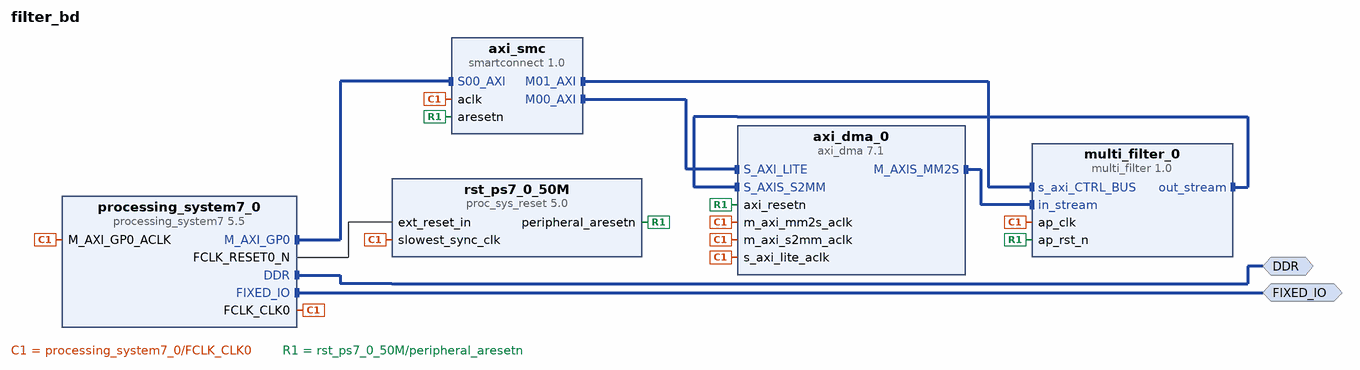
[diagram p0: block diagram of the top level]
# Vivado block design filter_bd, xc7z020clg484-1, Vivado 2024.2
create_bd_design filter_bd

create_bd_intf_port -mode Master -vlnv xilinx.com:interface:ddrx_rtl:1.0 DDR
create_bd_intf_port -mode Master -vlnv xilinx.com:display_processing_system7:fixedio_rtl:1.0 FIXED_IO

create_bd_cell -type ip -vlnv xilinx.com:ip:processing_system7:5.5 processing_system7_0
set_property -dict [list \
  CONFIG.PCW_UART1_PERIPHERAL_ENABLE 1 \
  CONFIG.PCW_UART1_UART1_IO {MIO 48 .. 49} \
  CONFIG.PCW_UART_PERIPHERAL_FREQMHZ 100 \
] [get_bd_cells processing_system7_0]
# 41 more settings of processing_system7_0 are not shown: defaults, MIO pin electricals, DDR timing, and values the tool derives
create_bd_cell -type ip -vlnv xilinx.com:ip:axi_dma:7.1 axi_dma_0
set_property -dict [list \
  CONFIG.c_include_sg 0 \
  CONFIG.c_m_axis_mm2s_tdata_width 8 \
  CONFIG.c_s_axis_s2mm_tdata_width 8 \
] [get_bd_cells axi_dma_0]
create_bd_cell -type ip -vlnv xilinx.com:hls:multi_filter:1.0 multi_filter_0
create_bd_cell -type ip -vlnv xilinx.com:ip:smartconnect:1.0 axi_smc
set_property -dict {CONFIG.NUM_MI 2 CONFIG.NUM_SI 1} [get_bd_cells axi_smc]
create_bd_cell -type ip -vlnv xilinx.com:ip:proc_sys_reset:5.0 rst_ps7_0_50M

# ---- connections ----

connect_bd_intf_net [get_bd_intf_pins axi_dma_0/M_AXIS_MM2S] [get_bd_intf_pins multi_filter_0/in_stream]
connect_bd_intf_net [get_bd_intf_pins axi_smc/M00_AXI] [get_bd_intf_pins axi_dma_0/S_AXI_LITE]
connect_bd_intf_net [get_bd_intf_pins axi_smc/M01_AXI] [get_bd_intf_pins multi_filter_0/s_axi_CTRL_BUS]
connect_bd_intf_net [get_bd_intf_pins multi_filter_0/out_stream] [get_bd_intf_pins axi_dma_0/S_AXIS_S2MM]
connect_bd_intf_net [get_bd_intf_ports DDR] [get_bd_intf_pins processing_system7_0/DDR]
connect_bd_intf_net [get_bd_intf_ports FIXED_IO] [get_bd_intf_pins processing_system7_0/FIXED_IO]
connect_bd_intf_net [get_bd_intf_pins processing_system7_0/M_AXI_GP0] [get_bd_intf_pins axi_smc/S00_AXI]
connect_bd_net [get_bd_pins processing_system7_0/FCLK_CLK0] \
  [get_bd_pins processing_system7_0/M_AXI_GP0_ACLK] [get_bd_pins axi_smc/aclk] [get_bd_pins axi_dma_0/s_axi_lite_aclk] \
  [get_bd_pins rst_ps7_0_50M/slowest_sync_clk] [get_bd_pins multi_filter_0/ap_clk] [get_bd_pins axi_dma_0/m_axi_mm2s_aclk] \
  [get_bd_pins axi_dma_0/m_axi_s2mm_aclk]
connect_bd_net [get_bd_pins processing_system7_0/FCLK_RESET0_N] [get_bd_pins rst_ps7_0_50M/ext_reset_in]
connect_bd_net [get_bd_pins rst_ps7_0_50M/peripheral_aresetn] \
  [get_bd_pins axi_dma_0/axi_resetn] [get_bd_pins axi_smc/aresetn] [get_bd_pins multi_filter_0/ap_rst_n]

# ---- address map ----
assign_bd_address -offset 0x40000000 -range 64K -target_address_space [get_bd_addr_spaces processing_system7_0/Data] [get_bd_addr_segs multi_filter_0/s_axi_CTRL_BUS/Reg]
assign_bd_address -offset 0x41E00000 -range 64K -target_address_space [get_bd_addr_spaces processing_system7_0/Data] [get_bd_addr_segs axi_dma_0/S_AXI_LITE/Reg]

validate_bd_design
save_bd_design
